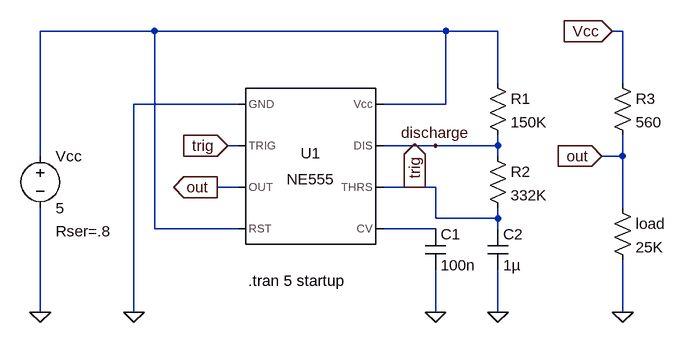
[diagram p0: schematic 555AstableFlipFlop.asc]
555AstableFlipFlop.asc, the LTspice schematic file:
Version 4
SHEET 1 880 680
WIRE -448 48 -624 48
WIRE 0 48 -448 48
WIRE 80 48 0 48
WIRE 272 48 256 48
WIRE 80 128 80 48
WIRE 272 128 272 48
WIRE -320 160 -480 160
WIRE 0 160 0 48
WIRE 0 160 -96 160
WIRE -320 224 -336 224
WIRE -16 224 -96 224
WIRE 80 224 80 208
WIRE 80 224 -16 224
WIRE -624 240 -624 48
WIRE 80 240 80 224
WIRE 272 240 272 208
WIRE 272 240 240 240
WIRE -320 288 -352 288
WIRE -48 288 -96 288
WIRE -16 288 -48 288
WIRE 272 320 272 240
WIRE -16 336 -16 288
WIRE 80 336 80 320
WIRE 80 336 -16 336
WIRE -448 352 -448 48
WIRE -320 352 -448 352
WIRE -16 352 -96 352
WIRE 80 352 80 336
WIRE -624 480 -624 320
WIRE -480 480 -480 160
WIRE -16 480 -16 416
WIRE 80 480 80 416
WIRE 272 480 272 400
FLAG -480 480 0
FLAG -16 480 0
FLAG 80 480 0
FLAG -624 480 0
FLAG 240 240 out
IOPIN 240 240 In
FLAG -352 288 out
IOPIN -352 288 Out
FLAG 256 48 Vcc
IOPIN 256 48 In
FLAG 272 480 0
FLAG -336 224 trig
IOPIN -336 224 In
FLAG -48 288 trig
IOPIN -48 288 Out
FLAG -16 224 discharge
SYMBOL Misc\\NE555 -208 256 R0
SYMATTR InstName U1
SYMBOL cap -32 352 R0
SYMATTR InstName C1
SYMATTR Value 100n
SYMBOL res 64 112 R0
SYMATTR InstName R1
SYMATTR Value 150K
SYMATTR SpiceLine tol=1 pwr=0.1
SYMBOL res 64 224 R0
SYMATTR InstName R2
SYMATTR Value 332K
SYMATTR SpiceLine tol=1 pwr=0.1
SYMBOL cap 64 352 R0
SYMATTR InstName C2
SYMATTR Value 1µ
SYMATTR SpiceLine V=25 Irms=0 Rser=0.007 MTBF=0 Lser=0 ppPkg=1
SYMBOL res 256 112 R0
SYMATTR InstName R3
SYMATTR Value 560
SYMBOL voltage -624 224 R0
WINDOW 123 0 0 Left 0
WINDOW 39 24 132 Left 0
SYMATTR SpiceLine Rser=.8
SYMATTR InstName Vcc
SYMATTR Value 5
SYMBOL res 256 304 R0
SYMATTR InstName load
SYMATTR Value 25K
TEXT -304 432 Left 0 !.tran 5 startup

The netlist it stands for:
* 555AstableFlipFlop.asc
XU1 0 trig out N001 N002 trig discharge N001 NE555  ; pins GND TRIG OUT RST CV THRS DIS Vcc
C1 N002 0 100n
R1 N001 discharge 150K tol=1 pwr=0.1
R2 discharge trig 332K tol=1 pwr=0.1
C2 trig 0 1µ V=25 Irms=0 Rser=0.007 MTBF=0 Lser=0 ppPkg=1
R3 Vcc out 560
Vcc N001 0 5 Rser=.8
R§load out 0 25K
.tran 5 startup
.lib NE555.sub
.backanno
.end